# Altium project RF Kill Transceiver V2.PrjPcb
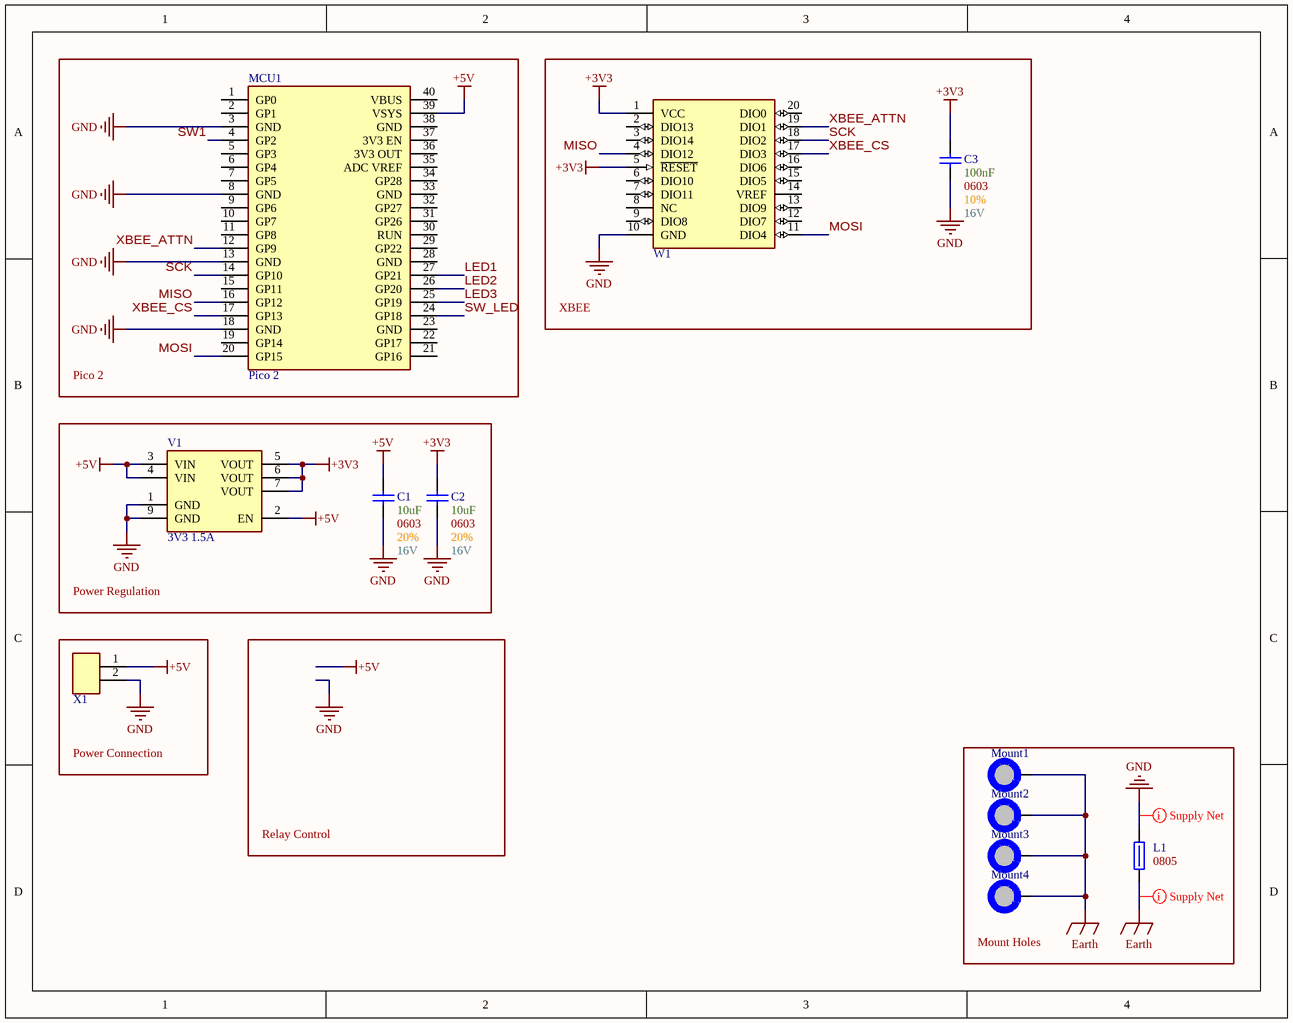
[diagram p0: Main.SchDoc]
2 sheets, 27 parts. Net scope: global (net labels, ports and power ports of the same name join across sheets).
Sheets:
  Main.SchDoc
  LEDs and Buttons.SchDoc

## Sheet Main.SchDoc
size A; SheetNumber: 1; SheetTotal: 2

### Parts
C1  Max Voltage: 16V  Size Package: 0603  Tolerance: 20%  Capacitance: 10uF  [[Cap] SMD 0603]  (hidden comment: [Cap] 0603 10uF 20% 16V)
C2  Max Voltage: 16V  Size Package: 0603  Tolerance: 20%  Capacitance: 10uF  [[Cap] SMD 0603]  (hidden comment: [Cap] 0603 10uF 20% 16V)
C3  Max Voltage: 16V  Size Package: 0603  Tolerance: 10%  Capacitance: 100nF  [[Cap] SMD 0603]  (hidden comment: [Cap] 0603 0.1uF 10% 16V)
L1  Size Package: 0805  [[Ferrite] SMD 0805]  (hidden comment: 652-MH2029-300Y)
MCU1  Pico 2  [[Pi] Pico 2]
Mount1  M3 Mount Hole  [[Mount] M3 Mount Hole]  (value not drawn)  (no BOM)
Mount2  M3 Mount Hole  [[Mount] M3 Mount Hole]  (value not drawn)  (no BOM)
Mount3  M3 Mount Hole  [[Mount] M3 Mount Hole]  (value not drawn)  (no BOM)
Mount4  M3 Mount Hole  [[Mount] M3 Mount Hole]  (value not drawn)  (no BOM)
V1  3V3 1.5A  [[Linear] 3V3 1.5A]
W1  [XBEE] 900HP  [[XBEE] 900HP]  (value not drawn)
X1  [Sherlock] 2pin  [[Sherlock] 2pin]  (value not drawn)

### Blocks framed on the sheet
Pico 2: MCU1
XBEE: C3 W1
Power Regulation: C1 C2 V1
Power Connection: X1
Mount Holes: L1 Mount1-Mount4

### Nets
+3V3: C2.2 C3.2 V1.5(VOUT) V1.6(VOUT) V1.7(VOUT) W1.1(VCC) W1.5(~{RESET})
+5V: C1.2 MCU1.39(VSYS) V1.2(EN) V1.3(VIN) V1.4(VIN) X1.1
Earth: L1.1 Mount1.1 Mount2.1 Mount3.1 Mount4.1
GND: C1.1 C2.1 C3.1 L1.2 MCU1.3(GND) MCU1.8(GND) MCU1.13(GND) MCU1.18(GND) V1.1(GND) V1.9(GND) W1.10(GND) X1.2
LED1: MCU1.27(GP21)
LED2: MCU1.26(GP20)
LED3: MCU1.25(GP19)
MISO: MCU1.16(GP12) W1.4(DIO12)
MOSI: MCU1.20(GP15) W1.11(DIO4)
SCK: MCU1.14(GP10) W1.18(DIO2)
SW1: MCU1.4(GP2)
SW_LED: MCU1.24(GP18)
XBEE_ATTN: MCU1.12(GP9) W1.19(DIO1)
XBEE_CS: MCU1.17(GP13) W1.17(DIO3)

Not connected (* = marked no-connect by the designer): MCU1 1(GP0) 2(GP1) 5(GP3) 6(GP4) 7(GP5) 9(GP6) 10(GP7) 11(GP8) 15(GP11) 19(GP14) 21(GP16) 22(GP17) 23(GND) 28(GND) 29(GP22) 30(RUN) 31(GP26) 32(GP27) 33(GND) 34(GP28) 35(ADC_VREF) 36(3V3_OUT) 37(3V3_EN) 38(GND) 40(VBUS); W1 2(DIO13) 3(DIO14) 6(DIO10) 7(DIO11) 8(NC) 9(DIO8) 12(DIO7) 13(DIO9) 14(VREF) 15(DIO5) 16(DIO6) 20(DIO0)

### Layout directives
net class Supply_Nets: Earth, GND

### Notes on the sheet
- Relay Control

### Library data of the parts
C1 C2 = [Cap] 0603 10uF 20% 16V: GRM188C81C106MA73D; Supplier 1: DigiKey; Supplier Part Number 1: 490-7198-1-ND
C3 = [Cap] 0603 0.1uF 10% 16V: CC0603KRX7R7BB104; Supplier 1: DigiKey; Supplier Part Number 1: 311-1088-6-ND
L1 = [Ferrite] SMD 0805 3A 30ohm: Res @ Freq: 30 @ 100MHz; Supplier 1: DigiKey; Supplier Part Number 1: MH2029-300YCT-ND
MCU1 = [Pi] Pico 2: SC1631; Supplier 1: DigiKey; Supplier Part Number 1: 2648-SC1631TR-ND
Mount1-Mount4 = [Mount] M3 Mount Hole: Place at least 4.5mm from board edge. Plated.
V1 = [Linear] 3V3 1.5A: AP7362A-33SP-13; Supplier 1: DigiKey; Supplier Part Number 1: AP7362A-33SP-13DICT-ND
W1 = [XBEE] 900HP: XBP9B-DMST-002; Supplier 1: DigiKey; Supplier Part Number 1: 602-1299-ND
X1 = [Sherlock] 2pin: 0353620250; Supplier 1: DigiKey; Supplier Part Number 1: WM18920-ND

## Sheet LEDs and Buttons.SchDoc
size A; SheetNumber: 2; SheetTotal: 2
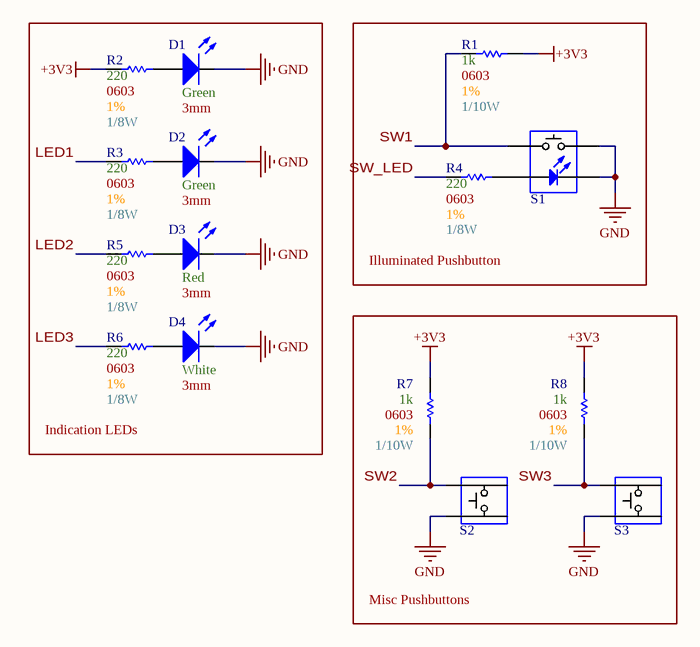
[diagram p1: LEDs and Buttons.SchDoc]

### Parts
D1  Color: Green  Lens Diameter: 3mm  [[LED] Thru-Hole 3mm]  (hidden comment: [LED] Thru-Hole 3mm Green)
D2  Color: Green  Lens Diameter: 3mm  [[LED] Thru-Hole 3mm]  (hidden comment: [LED] Thru-Hole 3mm Green)
D3  Color: Red  Lens Diameter: 3mm  [[LED] Thru-Hole 3mm]  (hidden comment: [LED] Thru-Hole 3mm Red)
D4  Color: White  Lens Diameter: 3mm  [[LED] Thru-Hole 3mm]  (hidden comment: [LED] Thru-Hole 3mm White)
R1  Wattage: 1/10W  Tolerance: 1%  Resistance: 1k  Size Package: 0603  [[Res] SMD 0603]  (hidden comment: [1k] SMD 0603 1% 1/10W)
R2  Wattage: 1/8W  Tolerance: 1%  Resistance: 220  Size Package: 0603  [[Res] SMD 0603]  (hidden comment: [220] SMD 0603 1% 1/10W)
R3  Wattage: 1/8W  Tolerance: 1%  Resistance: 220  Size Package: 0603  [[Res] SMD 0603]  (hidden comment: [220] SMD 0603 1% 1/10W)
R4  Wattage: 1/8W  Tolerance: 1%  Resistance: 220  Size Package: 0603  [[Res] SMD 0603]  (hidden comment: [220] SMD 0603 1% 1/10W)
R5  Wattage: 1/8W  Tolerance: 1%  Resistance: 220  Size Package: 0603  [[Res] SMD 0603]  (hidden comment: [220] SMD 0603 1% 1/10W)
R6  Wattage: 1/8W  Tolerance: 1%  Resistance: 220  Size Package: 0603  [[Res] SMD 0603]  (hidden comment: [220] SMD 0603 1% 1/10W)
R7  Wattage: 1/10W  Tolerance: 1%  Resistance: 1k  Size Package: 0603  [[Res] SMD 0603]  (hidden comment: [1k] SMD 0603 1% 1/10W)
R8  Wattage: 1/10W  Tolerance: 1%  Resistance: 1k  Size Package: 0603  [[Res] SMD 0603]  (hidden comment: [1k] SMD 0603 1% 1/10W)
S1  [SPST] Illuminated Red Pushbutton  [[SPST] Illuminated Red Pushbutton]  (value not drawn)
S2  Standard pushbutton  [[SPST] Pushbutton]  (value not drawn)
S3  Standard pushbutton  [[SPST] Pushbutton]  (value not drawn)

### Blocks framed on the sheet
Indication LEDs: D1-D4 R2 R3 R5 R6
Illuminated Pushbutton: R1 R4 S1
Misc Pushbuttons: R7 R8 S2 S3

### Nets
+3V3: R1.1 R2.1 R7.1 R8.1
GND: D1.2(Cathode) D2.2(Cathode) D3.2(Cathode) D4.2(Cathode) S1.2(COM_1) S1.6(K) S2.2 S3.2
LED1: R3.1
LED2: R5.1
LED3: R6.1
SW1: R1.2 S1.1(NO_1)
SW2: R7.2 S2.1
SW3: R8.2 S3.1
SW_LED: R4.1
NetD1_1: D1.1(Anode) R2.2
NetD2_1: D2.1(Anode) R3.2
NetD3_1: D3.1(Anode) R5.2
NetD4_1: D4.1(Anode) R6.2
NetR4_2: R4.2 S1.5(A)

### Library data of the parts
D1 D2 = [LED] Thru-Hole 3mm Green: 151031VS06000; Supplier 1: DigiKey; Supplier Part Number 1: 732-5008-ND
D3 = [LED] Thru-Hole 3mm Red: 151031SS06000; Supplier 1: DigiKey; Supplier Part Number 1: 732-5006-ND
D4 = [LED] Thru-Hole 3mm White: 151031VS06000; Supplier 1: DigiKey; Supplier Part Number 1: 1516-QBL7IW60D-WW-ND
R1 R7 R8 = [1k] SMD 0603 1% 1/10W: RMCF0603FT1K00; Supplier 1: DigiKey; Supplier Part Number 1: RMCF0603FT1K00DKR-ND
R2-R6 = [220] SMD 0603 1% 1/10W: CRGCQ0805F220R; Supplier 1: DigiKey; Supplier Part Number 1: A129741CT-ND
S1 = [SPST] Illuminated Red Pushbutton: B3W-9010-R1N; Supplier 1: DigiKey; Supplier Part Number 1: SW1111-ND
S2 S3 = [SPST] Pushbutton: Supplier 1: DigiKey; Supplier Part Number 1: 450-1650-ND

## Nets that join several sheets
+3V3: Main (7 pins), LEDs and Buttons (R1.1 R2.1 R7.1 R8.1)
GND: Main (12 pins), LEDs and Buttons (8 pins)
LED1: Main (MCU1.27), LEDs and Buttons (R3.1)
LED2: Main (MCU1.26), LEDs and Buttons (R5.1)
LED3: Main (MCU1.25), LEDs and Buttons (R6.1)
SW1: Main (MCU1.4), LEDs and Buttons (R1.2 S1.1)
SW_LED: Main (MCU1.24), LEDs and Buttons (R4.1)